# Altium schematic sheet adxl375.SchDoc
size A4; SheetNumber: 9; SheetTotal: 11
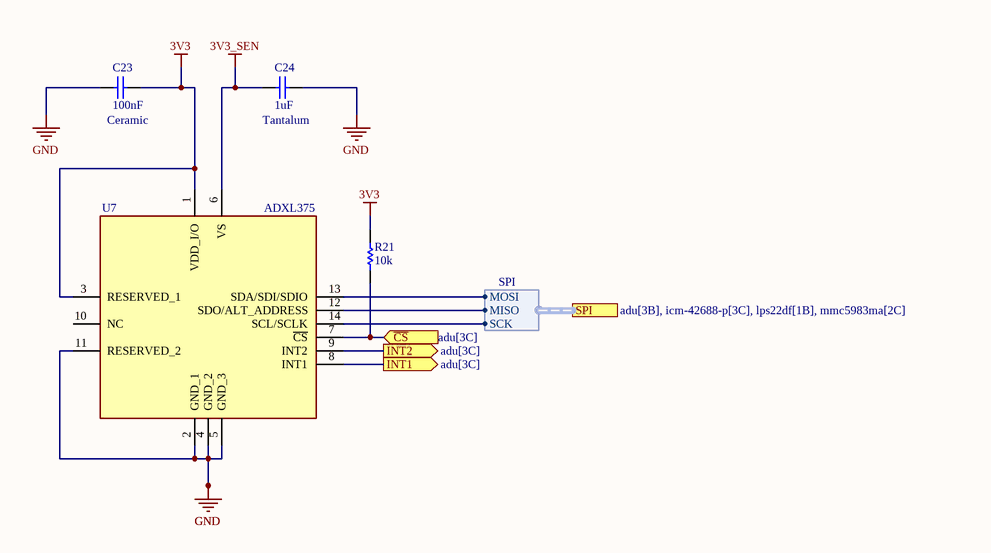
[diagram p0: adxl375.SchDoc]

## Parts
C23  value 100nF  [CAPC0603X33N]  (hidden comment: Cap)
C24  value 1uF  [CAPC0603X33N]  (hidden comment: Cap)
R21  10k  [RES-0603]
U7  ADXL375  [ADXL375]

## Ports
INT1 (out, see adu[3C]), INT2 (out, see adu[3C]), SPI (harness SPI, see adu[3B], icm-42688-p[3C], lps22df[1B], mmc5983ma[2C]), ~{CS} (in, see adu[3C])

## Harnesses
SPI: MISO, MOSI, SCK

## Nets
3V3: C23.1 R21.2 U7.1(VDD_I/O) U7.3(RESERVED_1)
3V3_SEN: C24.2 U7.6(VS)
GND: C23.2 C24.1 U7.2(GND_1) U7.4(GND_2) U7.5(GND_3) U7.11(RESERVED_2)
~{CS}: R21.1 U7.7(~{CS}) ; port ~{CS}
INT1: U7.8(INT1) ; port INT1
INT2: U7.9(INT2) ; port INT2
NetU7_12: U7.12(SDO/ALT_ADDRESS) ; port SPI.MISO
NetU7_13: U7.13(SDA/SDI/SDIO) ; port SPI.MOSI
NetU7_14: U7.14(SCL/SCLK) ; port SPI.SCK

Not connected (* = marked no-connect by the designer): U7 10(NC)

## Notes on the sheet
- (near C23) Ceramic
- (near C24) Tantalum

## Library data of the parts
C23 C24 = Cap: Capacitor; Published: 8-Jun-2000; LatestRevisionDate: 17-Jul-2002; LatestRevisionNote: Re-released for DXP Platform.; PackageReference: RAD-0.3; Publisher: Altium Limited; PackageDescription: Radial Cap, Thru-Hole; 2 Leads; 0.3 in Pin Spacing
  C24: Supplier 1: Rs; Supplier Part Number 1: 1362639
R21 = Resistor
U7 = ADXL375: 3-Axis, ±200 g / Digital MEMS Accelerometer